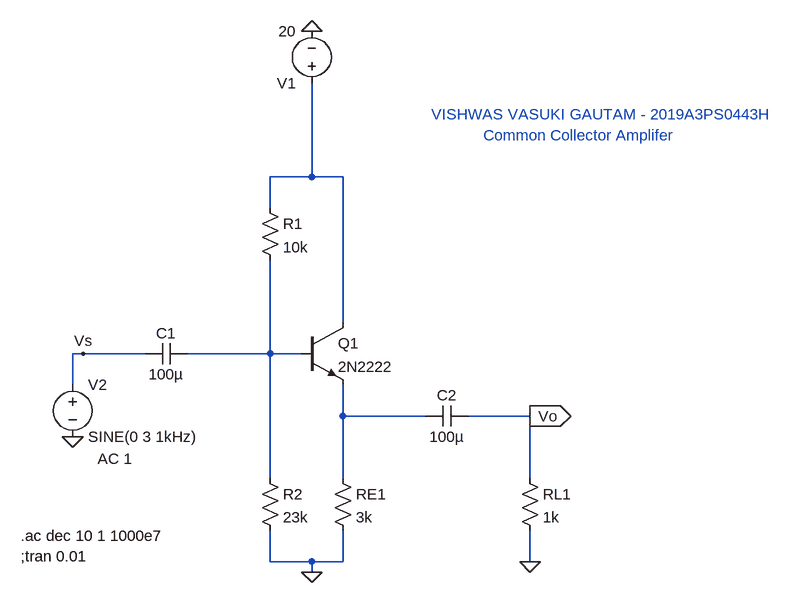
[diagram p0: schematic CC_amplifier.asc]
CC_amplifier.asc, the LTspice schematic file:
Version 4
SHEET 1 900 680
WIRE -224 -448 -224 -592
WIRE -224 -448 -288 -448
WIRE -176 -448 -224 -448
WIRE -288 -400 -288 -448
WIRE -176 -224 -176 -448
WIRE -576 -176 -592 -176
WIRE -480 -176 -576 -176
WIRE -288 -176 -288 -320
WIRE -288 -176 -416 -176
WIRE -240 -176 -288 -176
WIRE -592 -128 -592 -176
WIRE -176 -80 -176 -128
WIRE -48 -80 -176 -80
WIRE 112 -80 16 -80
WIRE -288 16 -288 -176
WIRE -176 16 -176 -80
WIRE 112 16 112 -80
WIRE -288 144 -288 96
WIRE -224 144 -288 144
WIRE -176 144 -176 96
WIRE -176 144 -224 144
WIRE 112 144 112 96
WIRE -224 160 -224 144
FLAG -592 -48 0
FLAG -224 -672 0
FLAG -224 160 0
FLAG 112 -80 Vo
IOPIN 112 -80 Out
FLAG -576 -176 Vs
FLAG 112 144 0
SYMBOL voltage -224 -576 R180
WINDOW 123 0 0 Left 2
WINDOW 39 0 0 Left 2
SYMATTR InstName V1
SYMATTR Value 20
SYMBOL voltage -592 -144 R0
WINDOW 123 38 130 Left 2
WINDOW 39 0 0 Left 2
SYMATTR Value2 AC 1
SYMATTR InstName V2
SYMATTR Value SINE(0 3 1kHz)
SYMBOL cap -416 -192 R90
WINDOW 0 0 32 VBottom 2
WINDOW 3 32 32 VTop 2
SYMATTR InstName C1
SYMATTR Value 100µ
SYMBOL res -304 -416 R0
SYMATTR InstName R1
SYMATTR Value 10k
SYMBOL npn -240 -224 R0
SYMATTR InstName Q1
SYMATTR Value 2N2222
SYMBOL res -304 0 R0
SYMATTR InstName R2
SYMATTR Value 23k
SYMBOL res -192 0 R0
SYMATTR InstName RE1
SYMATTR Value 3k
SYMBOL cap 16 -96 R90
WINDOW 0 0 32 VBottom 2
WINDOW 3 32 32 VTop 2
SYMATTR InstName C2
SYMATTR Value 100µ
SYMBOL res 96 0 R0
SYMATTR InstName RL1
SYMATTR Value 1k
TEXT -672 136 Left 2 !;tran 0.01
TEXT -672 104 Left 2 !.ac dec 10 1 1000e7
TEXT -40 -544 Left 2 ;VISHWAS VASUKI GAUTAM - 2019A3PS0443H
TEXT 40 -512 Left 2 ;Common Collector Amplifer

The netlist it stands for:
* CC_amplifier.asc
V1 N001 0 20
V2 Vs 0 SINE(0 3 1kHz) AC 1
C1 N002 Vs 100µ
R1 N001 N002 10k
Q1 N001 N002 N003 0 2N2222
R2 N002 0 23k
RE1 N003 0 3k
C2 Vo N003 100µ
RL1 Vo 0 1k
.model NPN NPN
.model PNP PNP
.lib standard.bjt
;tran 0.01
.ac dec 10 1 1000e7
* VISHWAS VASUKI GAUTAM - 2019A3PS0443H
* Common Collector Amplifer
.backanno
.end